# EAGLE design 38Khz IR Board (EAGLE 5.11)
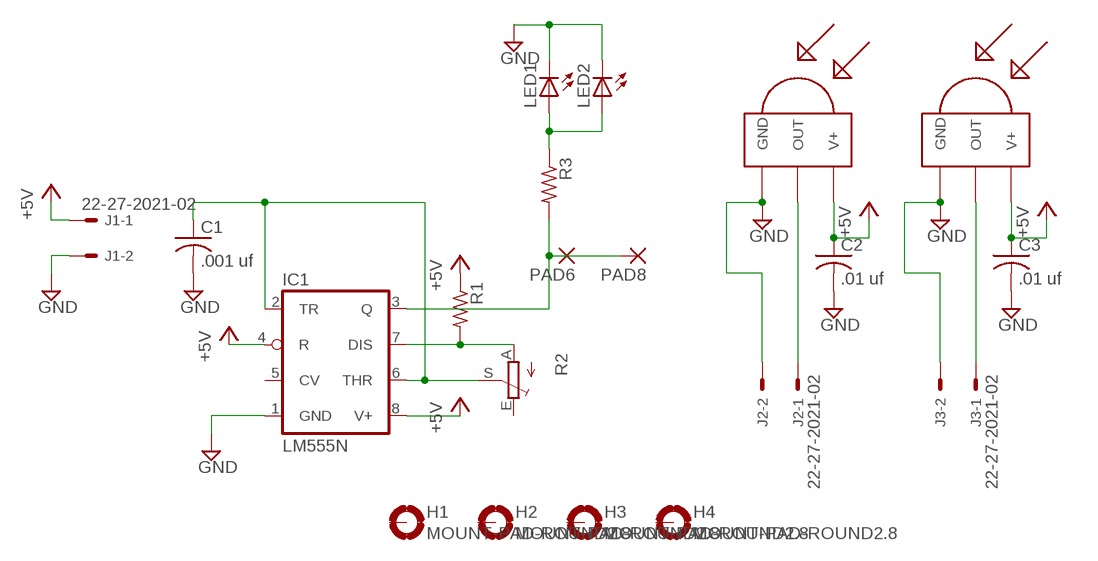
[diagram p0: schematic, sheet 1]

## Parts
C1  .001 uf  C-US025-025X050  [C025-025X050]
C2  .01 uf  C-US025-025X050  [C025-025X050]
C3  .01 uf  C-US025-025X050  [C025-025X050]
H1  MOUNT-PAD-ROUND2.8  [2,8-PAD]
H2  MOUNT-PAD-ROUND2.8  [2,8-PAD]
H3  MOUNT-PAD-ROUND2.8  [2,8-PAD]
H4  MOUNT-PAD-ROUND2.8  [2,8-PAD]
IC1  LM555N  [DIL08]
J1  22-27-2021-02  [6410-02]
J2  22-27-2021-02  [6410-02]
J3  22-27-2021-02  [6410-02]
LED1  LED5MM  [LED5MM]
LED2  LED5MM  [LED5MM]
PAD6  3,17/1,1  [3,17/1,1]
PAD8  3,17/1,1  [3,17/1,1]
R1  R-US_0309/V  [0309V]
R2  TRIM_EU-CA6V  [CA6V]
R3  R-US_0309/V  [0309V]
U$1  TSOP4838  [TSOP18XX]
U$2  TSOP4838  [TSOP18XX]

## Nets
+5V: C2.1 C3.1 IC1.4(R) IC1.8(V+) J1.1 R1.1 U$1.VCC(V+) U$2.VCC(V+)
GND: C1.2 C2.2 C3.2 IC1.1(GND) J1.2 J2.2 J3.2 LED1.K(C) LED2.K(C) U$1.GND U$2.GND
N$1: J2.1 U$1.OUT
N$2: J3.1 U$2.OUT
N$3: IC1.3(Q) PAD6.1(P) PAD8.1(P) R3.2
N$4: C1.1 IC1.2(TR) IC1.6(THR) R2.S
N$5: IC1.7(DIS) R1.2 R2.A
N$6: LED1.A LED2.A R3.1
Unconnected: H1.B2,8(MOUNT) H2.B2,8(MOUNT) H3.B2,8(MOUNT) H4.B2,8(MOUNT) IC1.5(CV) R2.E

## Library data of the parts
C1-C3 = rcl:C-US: CAPACITOR, American symbol
H1-H4 = holes:MOUNT-PAD-ROUND: MOUNTING PAD, round
IC1 = linear:*555: TIMER
J1-J3 = con-molex:22-?-02: CONNECTOR wire to board 2.54 mm (.1 inch) pitch header; OC_FARNELL: unknown; OC_NEWARK: unknown
LED1 LED2 = led:LED: LED OSRAM: - CHIPLED LG R971, LG N971, LY N971, LG Q971, LY Q971, LO R971, LY R971 LH N974, LH R974 LS Q976, LO Q976, LY Q976 LO Q996 - Hyper CHIPLED LW Q18S LB Q993, LB Q99A, LB R99A - SideLED LS A670, LO A670, LY A670, LG A670, LP A670 LB A673, LV A673, LT A673, LW A673 LH A674 LY A675 LS A676, LA A676, LO A676, LY A676, LW A676 LS A679, LY A679, LG A679 - Hyper Micro SIDELED® LS Y876, LA Y876, LO Y876, LY Y876 LT Y87S - SmartLED LW L88C, LW L88S LB L89C, LB L89S, LG L890 LS L89K, LO L89K, LY L89K LS L896, LA L896, LO L896, LY L896 - TOPLED LS T670, LO T670, LY T670, LG T670, LP T670 LSG T670, LSP T670, LSY T670, LOP T670, LYG T670 LG T671, LOG T671, LSG T671 LB T673, LV T673, LT T673, LW T673 LH T674 LS T676, LA T676, LO T676, LY T676, LB T676, LH T676, LSB T676, LW T676 LB T67C, LV T67C, LT T67C, LS T67K, LO T67K, LY T67K, LW E67C LS E67B, LA E67B, LO E67B, LY E67B, LB E67C, LV E67C, LT E67C LW T67C LS T679, LY T679, LG T679 LS T770, LO T770, LY T770, LG T770, LP T770 LB T773, LV T773, LT T773, LW T773 LH T774 LS E675, LA E675, LY E675, LS T675 LS T776, LA T776, LO T776, LY T776, LB T776 LHGB T686 LT T68C, LB T68C - Hyper Mini TOPLED® LB M676 - Mini TOPLED Santana® LG M470 LS M47K, LO M47K, LY M47K Source: http://www.osram.convergy.de LUXEON: - LUMILED® LXK2-PW12-R00, LXK2-PW12-S00, LXK2-PW14-U00, LXK2-PW14-V00 LXK2-PM12-R00, LXK2-PM12-S00, LXK2-PM14-U00 LXK2-PE12-Q00, LXK2-PE12-R00, LXK2-PE12-S00, LXK2-PE14-T00, LXK2-PE14-U00 LXK2-PB12-K00, LXK2-PB12-L00, LXK2-PB12-M00, LXK2-PB14-N00, LXK2-PB14-P00, LXK2-PB14-Q00 LXK2-PR12-L00, LXK2-PR12-M00, LXK2-PR14-Q00, LXK2-PR14-R00 LXK2-PD12-Q00, LXK2-PD12-R00, LXK2-PD12-S00 LXK2-PH12-R00, LXK2-PH12-S00 LXK2-PL12-P00, LXK2-PL12-Q00, LXK2-PL12-R00 Source: www.luxeon.com KINGBRIGHT: KA-3528ASYC Source: www.kingbright.com
PAD6 PAD8 = wirepad:3,17/1,1: THROUGH-HOLE PAD
R1 R3 = rcl:R-US_: RESISTOR, American symbol
R2 = pot:TRIM_EU-: POTENTIOMETER
U$1 U$2 = tsop:TSOP4838: IR Receiver and Demodulator

## Board
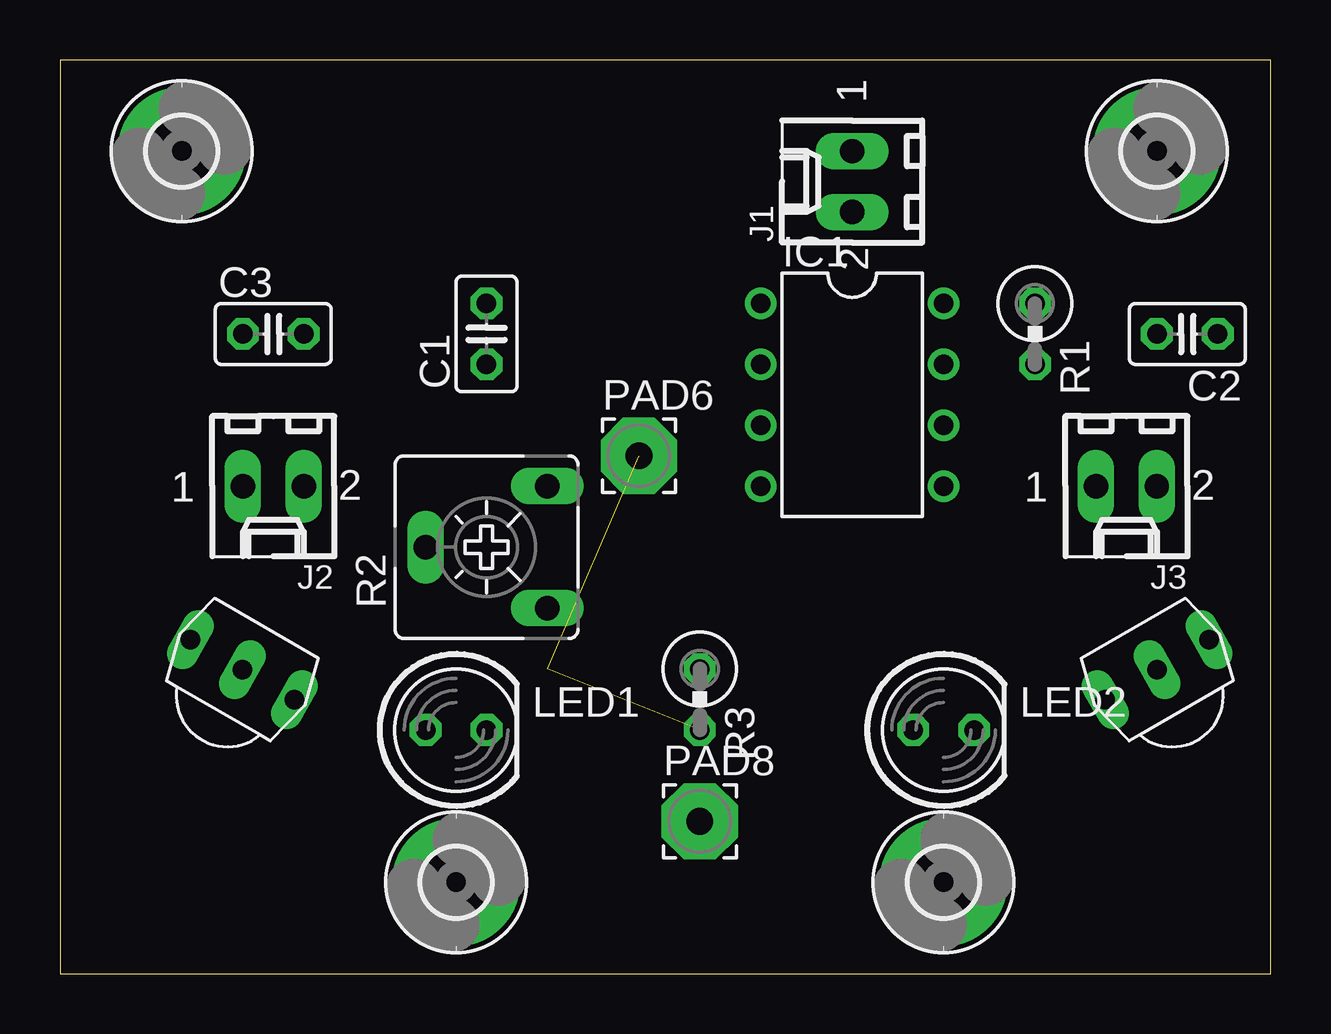
[diagram p1: board, top side]
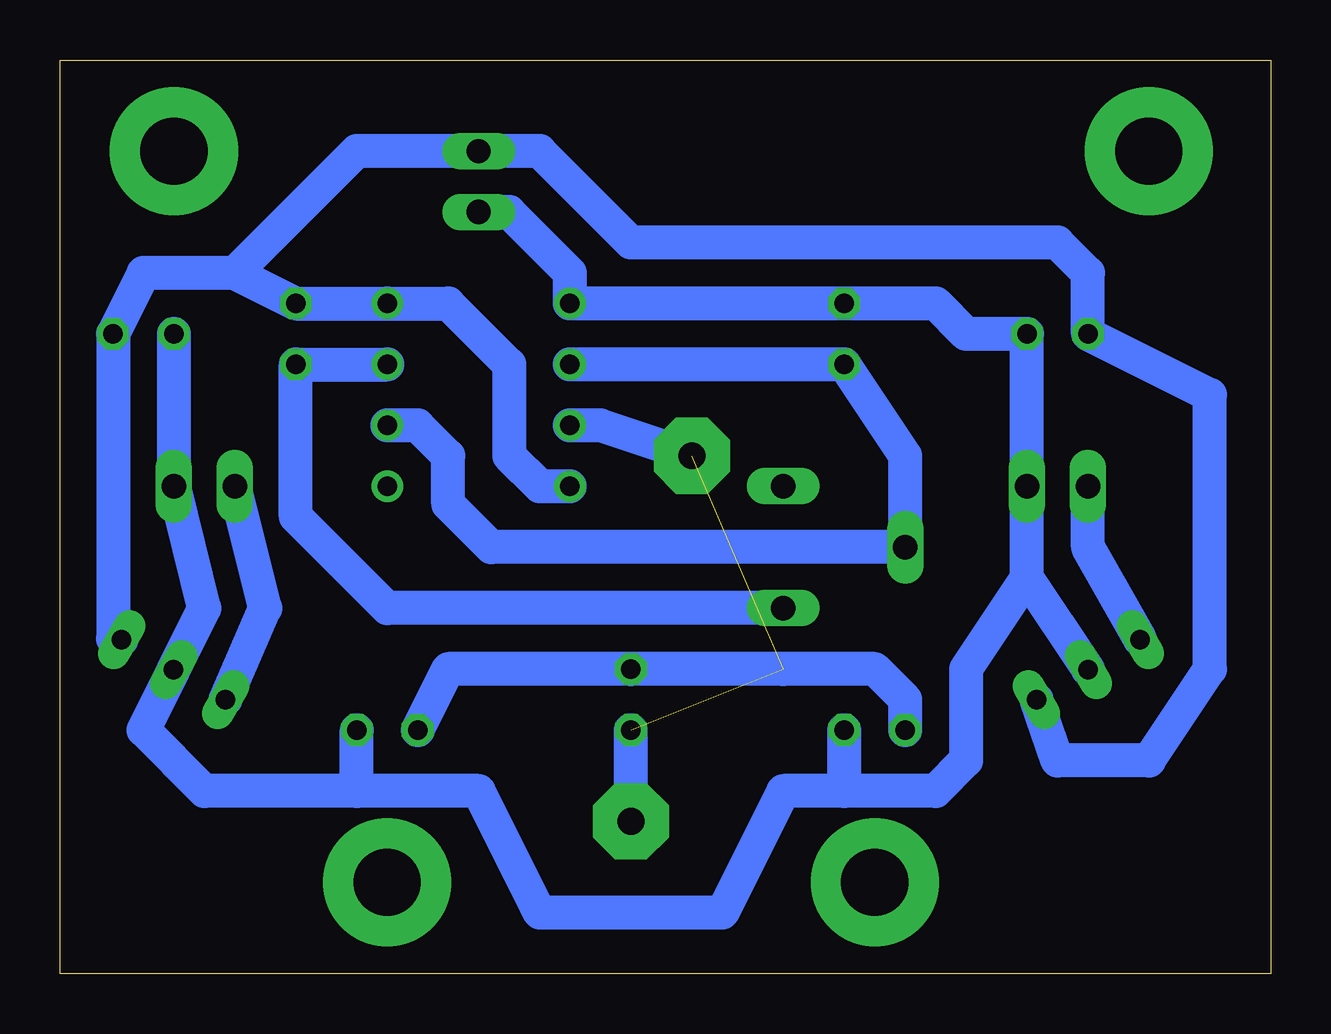
[diagram p2: board, bottom side, seen from below]

Size 50.47 x 38.09 mm. Coordinates in mm from the lower left corner, seen from the top.
Outline: 0,0 50.47,0 50.47,38.09 0,38.09 0,0
Copper layers (1*16): Top 0.035mm / dielectric 1.5mm / Bottom 0.035mm
Design rules "default": minimum track width 10mil, minimum drill 24mil, track to track 8mil, track to pad 8mil, pad to pad 8mil, via to via 8mil, smd to smd 8mil, copper to edge 40mil, drill to drill 8mil, minimum pad ring 10mil, minimum via ring 8mil, stop-mask expansion 4mil, vias tented up to drill 0mil, thermal gap 10mil

### Footprints (pad centres in the part's own frame; a part is rotated, then mirrored left to right if it is on the bottom)
C025-025X050 = drill 0.813 octagon: 1 -1.27,0; 2 1.27,0
2,8-PAD = drill 2.8 pad 5.334 round: B2,8 0,0
DIL08 = drill 0.813 pad 1.27 round: 1 -3.81,-3.81; 2 -1.27,-3.81; 3 1.27,-3.81; 4 3.81,-3.81; 5 3.81,3.81; 6 1.27,3.81; 7 -1.27,3.81; 8 -3.81,3.81
6410-02 = drill 1.016 long: 1 1.27,0; 2 -1.27,0
LED5MM = drill 0.813 octagon: A -1.27,0; K 1.27,0
3,17/1,1 = drill 1.118 pad 3.175 octagon: 1 0,0
0309V = drill 0.813 octagon: 1 -1.27,0; 2 1.27,0
CA6V = drill 1.016 long: A -2.54,-2.54; E 2.54,-2.54; S 0,2.54
TSOP18XX = drill 0.813 long: GND -0.001,-0.027; OUT -2.501,-0.027; VCC 2.499,-0.027

### Placement (x,y rotation side)
C1  17.78,26.67 90 top
C2  46.99,26.67 180 top
C3  8.89,26.67 0 top
H1  16.51,3.81 0 top
H2  36.83,3.81 0 top
H3  5.08,34.29 0 top
H4  45.72,34.29 0 top
IC1  33.02,24.13 270 top
J1  33.02,33.02 90 top
J2  8.89,20.32 180 top
J3  44.45,20.32 180 top
LED1  16.51,10.16 0 top
LED2  36.83,10.16 0 top
PAD6  24.13,21.59 0 top
PAD8  26.67,6.35 0 top
R1  40.64,26.67 270 top
R2  17.78,17.78 90 top
R3  26.67,11.43 270 top
U$1  7.62,12.7 330 top
U$2  45.72,12.7 30 top

### Tracks (layer width: path | path; a pad name or v marks a point on that pad's centre or on a via)
+5V
  Bottom 1.422: IC1.4 30.48,20.32 31.75,21.59 31.75,25.4 34.29,27.94 IC1.8 R1.1 43.18,29.21 | 43.18,29.21 46.99,29.21 C2.1 48.26,13.97 U$2.VCC | U$1.VCC 8.89,8.89 5.08,8.89 2.54,12.7 2.54,24.13 C3.1 7.62,29.21 8.89,30.48 26.67,30.48 30.48,34.29 J1.1 38.1,34.29 43.18,29.21
GND
  Bottom 1.422: C2.2 J3.2 44.45,15.24 U$2.GND 46.99,10.16 44.45,7.62 38.1,7.62 | 10.16,16.51 J2.2 C3.2 12.7,26.67 13.97,27.94 C1.2 IC1.1 29.21,29.21 31.75,31.75 J1.2 | U$1.GND 10.16,16.51 | 17.78,7.62 20.32,7.62 22.86,2.54 30.48,2.54 33.02,7.62 38.1,7.62 | 38.1,7.62 LED2.K | 17.78,7.62 LED1.K | 17.78,7.62 13.97,7.62 12.7,8.89 12.7,12.7 10.16,16.51
N$1
  Bottom 1.422: J2.1 7.62,17.78 U$1.OUT
N$2
  Bottom 1.422: J3.1 41.91,15.24 U$2.OUT
N$3  (2 unrouted)
  Bottom 1.422: IC1.3 27.94,22.86 PAD6.1 | 20.32,12.7 16.51,12.7 15.24,11.43 | PAD8.1 R3.2
N$4
  Bottom 1.422: IC1.2 C1.1 15.24,21.59 R2.S 32.49,17.78 34.29,19.58 34.29,21.59 35.56,22.86 IC1.6
N$5
  Bottom 1.422: IC1.7 R1.2 40.64,19.05 36.83,15.24 R2.A
N$6
  Bottom 1.422: LED1.A 15.24,11.43 16.51,12.7 R3.1 34.29,12.7 LED2.A